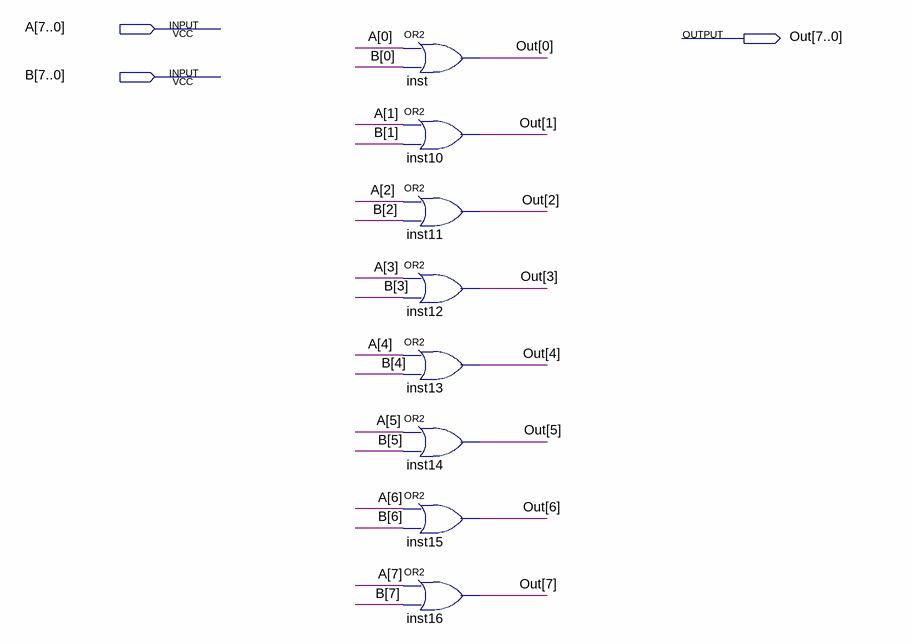
[diagram p0: schematic sheet]
// Quartus schematic Or_8bits.bdf as structural Verilog: 8 symbols, 3 pins
module Or_8bits (
  input  [7:0] A,
  input  [7:0] B,
  output [7:0] Out
);

  or inst (Out[0], A[0], B[0]);
  or inst10 (Out[1], A[1], B[1]);
  or inst11 (Out[2], A[2], B[2]);
  or inst12 (Out[3], A[3], B[3]);
  or inst13 (Out[4], A[4], B[4]);
  or inst14 (Out[5], A[5], B[5]);
  or inst15 (Out[6], A[6], B[6]);
  or inst16 (Out[7], A[7], B[7]);
endmodule
